# EAGLE schematic xuefei-lab7 (EAGLE 7.5.0)
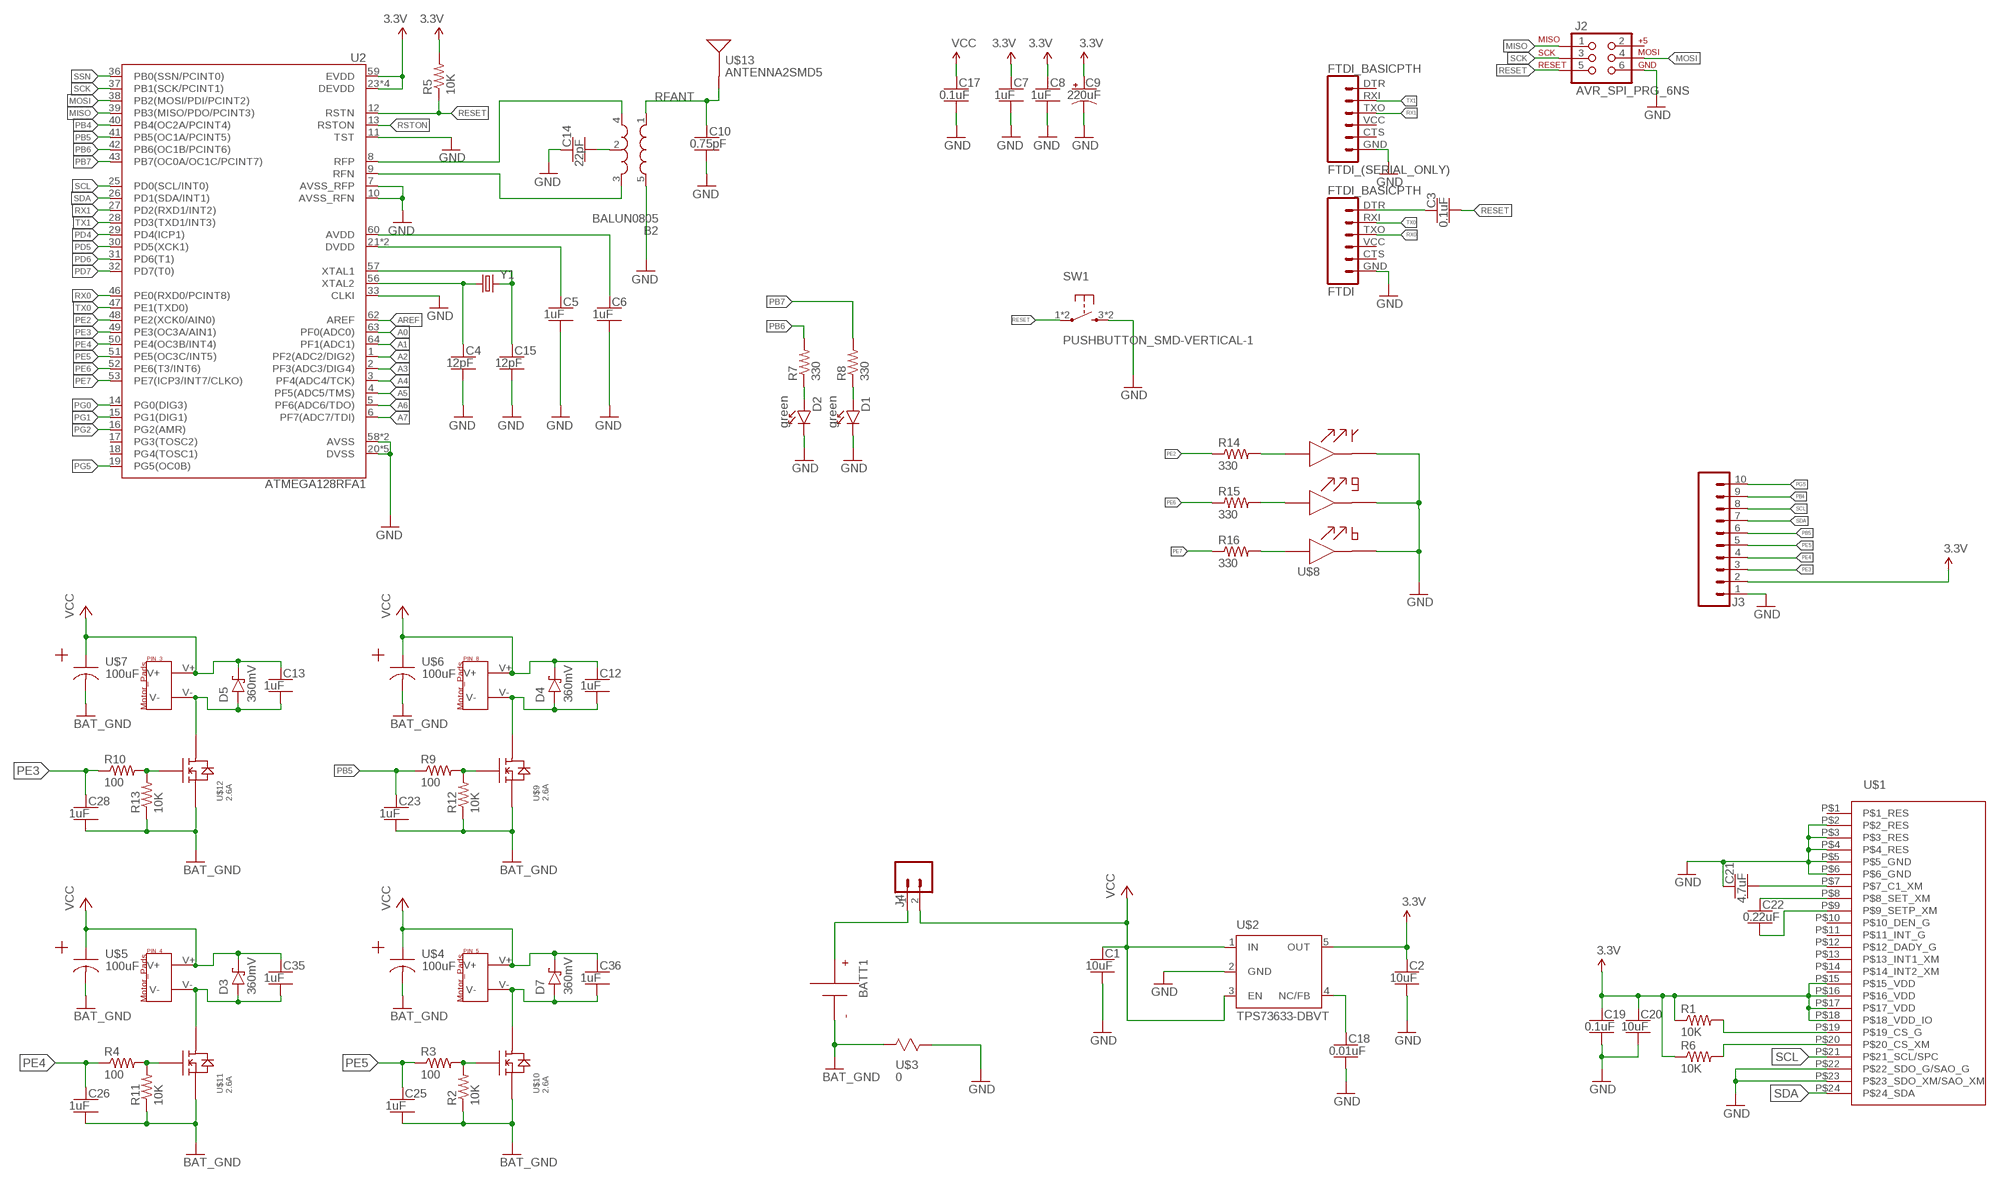
[diagram p0: schematic, sheet 1]

## Parts
B2  BALUN0805  [BALUN]
BATT1  BATTERY-HUBSAN-W/HOLDER  [BATTERY-W/HOLDER-380MAH-HUBSAN]
C1  10uF  CAPACITOR-NP_SMD-2012-0805_CERAMIC-10UF  [CAPC2012X140_HS]
C2  10uF  CAPACITOR-NP_SMD-2012-0805_CERAMIC-10UF  [CAPC2012X140_HS]
C3  0.1uF  CAPACITOR-NP_SMD-2012-0805_CERAMIC-0.1UF  [CAPC2012X140_HS]
C4  12pF  CAPACITOR-NP_SMD-2012-0805_CERAMIC-12PF  [CAPC2012X140_HS]
C5  1uF  CAPACITOR-NP_SMD-2012-0805_CERAMIC-1UF  [CAPC2012X140_HS]
C6  1uF  CAPACITOR-NP_SMD-2012-0805_CERAMIC-1UF  [CAPC2012X140_HS]
C7  1uF  CAPACITOR-NP_SMD-2012-0805_CERAMIC-1UF  [CAPC2012X140_HS]
C8  1uF  CAPACITOR-NP_SMD-2012-0805_CERAMIC-1UF  [CAPC2012X140_HS]
C9  220uF  CAPACITOR-POL_SMD-7043-D_TANTALUM-220UF  [CAPMP7343X310_HS]
C10  0.75pF  CAPACITOR-NP_SMD-2012-0805_CERAMIC-0.75PF  [CAPC2012X140_HS]
C12  1uF  CAPACITOR-NP_SMD-2012-0805_CERAMIC-1UF  [CAPC2012X140_HS]
C13  1uF  CAPACITOR-NP_SMD-2012-0805_CERAMIC-1UF  [CAPC2012X140_HS]
C14  22pF  CAPACITOR-NP_SMD-2012-0805_CERAMIC-22PF  [CAPC2012X140_HS]
C15  12pF  CAPACITOR-NP_SMD-2012-0805_CERAMIC-12PF  [CAPC2012X140_HS]
C17  0.1uF  CAPACITOR-NP_SMD-2012-0805_CERAMIC-0.1UF  [CAPC2012X140_HS]
C18  0.01uF  CAPACITOR-NP_SMD-2012-0805_CERAMIC-0.01UF  [CAPC2012X140_HS]
C19  0.1uF  CAPACITOR-NP_SMD-2012-0805_CERAMIC-0.1UF  [CAPC2012X140_HS]
C20  10uF  CAPACITOR-NP_SMD-2012-0805_CERAMIC-10UF  [CAPC2012X140_HS]
C21  4.7uF  CAPACITOR-NP_SMD-2012-0805_CERAMIC-4.7UF  [CAPC2012X140_HS]
C22  0.22uF  CAPACITOR-NP_SMD-2012-0805_CERAMIC-0.22UF  [CAPC2012X140_HS]
C23  1uF  CAPACITOR-NP_SMD-2012-0805_CERAMIC-1UF  [CAPC2012X140_HS]
C25  1uF  CAPACITOR-NP_SMD-2012-0805_CERAMIC-1UF  [CAPC2012X140_HS]
C26  1uF  CAPACITOR-NP_SMD-2012-0805_CERAMIC-1UF  [CAPC2012X140_HS]
C28  1uF  CAPACITOR-NP_SMD-2012-0805_CERAMIC-1UF  [CAPC2012X140_HS]
C35  1uF  CAPACITOR-NP_SMD-2012-0805_CERAMIC-1UF  [CAPC2012X140_HS]
C36  1uF  CAPACITOR-NP_SMD-2012-0805_CERAMIC-1UF  [CAPC2012X140_HS]
D1  green  DIODE-LED_SMD-2012-0805-GREEN  [LEDSC125X200X120-2_HS]
D2  green  DIODE-LED_SMD-2012-0805-GREEN  [LEDSC125X200X120-2_HS]
D3  360mV  DIODE-SCHOTTKY_SMD-SOD123-360MV  [SOD3716X135_HS]
D4  360mV  DIODE-SCHOTTKY_SMD-SOD123-360MV  [SOD3716X135_HS]
D5  360mV  DIODE-SCHOTTKY_SMD-SOD123-360MV  [SOD3716X135_HS]
D7  360mV  DIODE-SCHOTTKY_SMD-SOD123-360MV  [SOD3716X135_HS]
FTDI  FTDI_BASICPTH  [FTDI_BASIC]
FTDI_(SERIAL_ONLY)  FTDI_BASICPTH  [FTDI_BASIC]
J2  AVR_SPI_PRG_6NS  [2X3-NS]
J3  SIP-10_TH-254X10-1  [HDRV10W63P254_10X1_2540X254H838_HS]
J4  MALE_HEADER_2POS-2X1-0.1IN  [MALE_HEADER_2X1_0.1IN]
PIN_3  MOTOR_PADS  [MOTOR_PADS]
PIN_4  MOTOR_PADS  [MOTOR_PADS]
PIN_5  MOTOR_PADS  [MOTOR_PADS]
PIN_8  MOTOR_PADS  [MOTOR_PADS]
R1  10K  RESISTOR_SMD-2012-0805-10K  [RESC2012X60_HS]
R2  10K  RESISTOR_SMD-2012-0805-10K  [RESC2012X60_HS]
R3  100  RESISTOR_SMD-2012-0805-100  [RESC2012X60_HS]
R4  100  RESISTOR_SMD-2012-0805-100  [RESC2012X60_HS]
R5  10K  RESISTOR_SMD-2012-0805-10K  [RESC2012X60_HS]
R6  10K  RESISTOR_SMD-2012-0805-10K  [RESC2012X60_HS]
R7  330  RESISTOR_SMD-2012-0805-330  [RESC2012X60_HS]
R8  330  RESISTOR_SMD-2012-0805-330  [RESC2012X60_HS]
R9  100  RESISTOR_SMD-2012-0805-100  [RESC2012X60_HS]
R10  100  RESISTOR_SMD-2012-0805-100  [RESC2012X60_HS]
R11  10K  RESISTOR_SMD-2012-0805-10K  [RESC2012X60_HS]
R12  10K  RESISTOR_SMD-2012-0805-10K  [RESC2012X60_HS]
R13  10K  RESISTOR_SMD-2012-0805-10K  [RESC2012X60_HS]
R14  330  RESISTOR_SMD-2012-0805-330  [RESC2012X60_HS]
R15  330  RESISTOR_SMD-2012-0805-330  [RESC2012X60_HS]
R16  330  RESISTOR_SMD-2012-0805-330  [RESC2012X60_HS]
SW1  PUSHBUTTON_SMD-VERTICAL-1  [TE_FSM8JSMA_HS]
U2  ATMEGA128RFA1  [QFN-64]
U$1  IMU  [LGA-24_4X4MM]
U$2  TPS73633-DBVT  [SOT23-DBV]
U$3  0  RESISTOR  [SMD_RESISTOR]
U$4  100uF  POLAR_CAP  [TAJB_SMB_POLAR_CAP]
U$5  100uF  POLAR_CAP  [TAJB_SMB_POLAR_CAP]
U$6  100uF  POLAR_CAP  [TAJB_SMB_POLAR_CAP]
U$7  100uF  POLAR_CAP  [TAJB_SMB_POLAR_CAP]
U$8  QBLP679E-RGB  [QBLP679E-RGB]
U$9  2.6A  N-CHANNEL_MOSFETW/_HEAT_SINK  [LITTLE_FOOT_MOSFET_W/_HEAT_SPREADER]
U$10  2.6A  N-CHANNEL_MOSFETW/_HEAT_SINK  [LITTLE_FOOT_MOSFET_W/_HEAT_SPREADER]
U$11  2.6A  N-CHANNEL_MOSFETW/_HEAT_SINK  [LITTLE_FOOT_MOSFET_W/_HEAT_SPREADER]
U$12  2.6A  N-CHANNEL_MOSFETW/_HEAT_SINK  [LITTLE_FOOT_MOSFET_W/_HEAT_SPREADER]
U$13  ANTENNA2SMD5  [ANTENNA-CHIP5]
Y1  CRYSTAL5X3  [CRYSTAL-SMD-5X3]

## Nets
3.3V: C2.1 C7.1 C8.1 C9.1(+) C19.1 C20.1 J3.2 R1.1 R5.2 R6.1 U2.23(DEVDD) U2.34(DEVDD) U2.44(DEVDD) U2.54(DEVDD) U2.59(EVDD) U$1.P$15(P$15_VDD) U$1.P$16(P$16_VDD) U$1.P$17(P$17_VDD) U$1.P$18(P$18_VDD_IO) U$2.5(OUT)
A0: U2.63(PF0(ADC0))
A1: U2.64(PF1(ADC1))
A2: U2.1(PF2(ADC2/DIG2))
A3: U2.2(PF3(ADC3/DIG4))
A4: U2.3(PF4(ADC4/TCK))
A5: U2.4(PF5(ADC5/TMS))
A6: U2.5(PF6(ADC6/TDO))
A7: U2.6(PF7(ADC7/TDI))
AREF: U2.62(AREF)
AVDD: C6.1 U2.60(AVDD)
BAT_GND: BATT1.-(N) C23.2 C25.2 C26.2 C28.2 R2.1 R11.1 R12.1 R13.1 U$3.P$1 U$4.P$2 U$5.P$2 U$6.P$2 U$7.P$2 U$9.P$2(P$2_S) U$10.P$2(P$2_S) U$11.P$2(P$2_S) U$12.P$2(P$2_S)
DTR: C3.1 FTDI.DTR
DVDD: C5.1 U2.21(DVDD) U2.22(DVDD)
GND: B2.5(GND) C1.2 C2.2 C4.2 C5.2 C6.2 C7.2 C8.2 C9.2(-) C10.2 C14.1 C15.2 C17.2 C18.2 C19.2 C20.2 C21.1 D1.C D2.C FTDI.GND FTDI_(SERIAL_ONLY).GND J2.6 J3.1 SW1.3 SW1.4 U2.7(AVSS_RFP) U2.10(AVSS_RFN) U2.11(TST) U2.20(DVSS) U2.24(DVSS) U2.33(CLKI) U2.35(DVSS) U2.45(DVSS) U2.55(DVSS) U2.58(AVSS) U2.61(AVSS) U$1.P$2(P$2_RES) U$1.P$3(P$3_RES) U$1.P$4(P$4_RES) U$1.P$5(P$5_GND) U$1.P$6(P$6_GND) U$1.P$22(P$22_SDO_G/SAO_G) U$1.P$23(P$23_SDO_XM/SAO_XM) U$2.2(GND) U$3.P$2 U$8.P$1 U$8.P$2 U$8.P$3
MISO: J2.1 U2.39(PB3(MISO/PDO/PCINT3))
MOSI: J2.4 U2.38(PB2(MOSI/PDI/PCINT2))
N$1: R14.2 U$8.P$4
N$2: R15.2 U$8.P$5
N$3: C15.1 U2.57(XTAL1) Y1.3
N$4: C4.1 U2.56(XTAL2) Y1.1
N$5: C18.1 U$2.4(NC/FB)
N$6: C21.2 U$1.P$7(P$7_C1_XM)
N$7: B2.2(GND) C14.2
N$8: D2.A R7.1
N$9: R16.2 U$8.P$6
N$12: C22.1 U$1.P$8(P$8_SET_XM)
N$13: D1.A R8.1
N$14: C22.2 U$1.P$9(P$9_SETP_XM)
N$15: R1.2 U$1.P$19(P$19_CS_G)
N$16: R6.2 U$1.P$20(P$20_CS_XM)
N$17: BATT1.+(P) J4.1
N$18: R9.2 R12.2 U$9.P$1(P$1_G)
N$19 [HighAmps]: C12.2 D4.A PIN_8.V- U$9.P$3(P$3_D)
N$21: R2.2 R3.2 U$10.P$1(P$1_G)
N$22 [HighAmps]: C36.2 D7.A PIN_5.V- U$10.P$3(P$3_D)
N$24: R10.2 R13.2 U$12.P$1(P$1_G)
N$25 [HighAmps]: C13.2 D5.A PIN_3.V- U$12.P$3(P$3_D)
N$27: R4.2 R11.2 U$11.P$1(P$1_G)
N$28 [HighAmps]: C35.2 D3.A PIN_4.V- U$11.P$3(P$3_D)
PB4: J3.9 U2.40(PB4(OC2A/PCINT4))
PB5: C23.1 J3.6 R9.1 U2.41(PB5(OC1A/PCINT5))
PB6: R7.2 U2.42(PB6(OC1B/PCINT6))
PB7: R8.2 U2.43(PB7(OC0A/OC1C/PCINT7))
PD4: U2.29(PD4(ICP1))
PD5: U2.30(PD5(XCK1))
PD6: U2.31(PD6(T1))
PD7: U2.32(PD7(T0))
PE2: R14.1 U2.48(PE2(XCK0/AIN0))
PE3: C28.1 J3.3 R10.1 U2.49(PE3(OC3A/AIN1))
PE4: C26.1 J3.4 R4.1 U2.50(PE4(OC3B/INT4))
PE5: C25.1 J3.5 R3.1 U2.51(PE5(OC3C/INT5))
PE6: R15.1 U2.52(PE6(T3/INT6))
PE7: R16.1 U2.53(PE7(ICP3/INT7/CLKO))
PG0: U2.14(PG0(DIG3))
PG1: U2.15(PG1(DIG1))
PG2: U2.16(PG2(AMR))
PG5: J3.10 U2.19(PG5(OC0B))
RESET: C3.2 J2.5 R5.1 SW1.1 SW1.2 U2.12(RSTN)
RFANT: B2.1(IN) C10.1 U$13.FEED(SIGNAL)
RFN: B2.3(OUT2) U2.9(RFN)
RFP: B2.4(OUT1) U2.8(RFP)
RSTON: U2.13(RSTON)
RX0: FTDI.TXO U2.46(PE0(RXD0/PCINT8))
RX1: FTDI_(SERIAL_ONLY).TXO U2.27(PD2(RXD1/INT2))
SCK: J2.3 U2.37(PB1(SCK/PCINT1))
SCL: J3.8 U2.25(PD0(SCL/INT0)) U$1.P$21(P$21_SCL/SPC)
SDA: J3.7 U2.26(PD1(SDA/INT1)) U$1.P$24(P$24_SDA)
SSN: U2.36(PB0(SSN/PCINT0))
TX0: FTDI.RXI U2.47(PE1(TXD0))
TX1: FTDI_(SERIAL_ONLY).RXI U2.28(PD3(TXD1/INT3))
VCC: C1.1 C12.1 C13.1 C17.1 C35.1 C36.1 D3.C D4.C D5.C D7.C J4.2 PIN_3.V+ PIN_4.V+ PIN_5.V+ PIN_8.V+ U$2.1(IN) U$2.3(EN) U$4.P$1 U$5.P$1 U$6.P$1 U$7.P$1
Unconnected: FTDI.CTS FTDI.VCC FTDI_(SERIAL_ONLY).CTS FTDI_(SERIAL_ONLY).DTR FTDI_(SERIAL_ONLY).VCC J2.2 U2.17(PG3(TOSC2)) U2.18(PG4(TOSC1)) U$1.P$1(P$1_RES) U$1.P$10(P$10_DEN_G) U$1.P$11(P$11_INT_G) U$1.P$12(P$12_DADY_G) U$1.P$13(P$13_INT1_XM) U$1.P$14(P$14_INT2_XM)

## Library data of the parts
B2 = quadparts_prebuilt:BALUN: 0805 footprint balun- Ember 351/357; DATASHEET: http://katalog.we-online.de/pbs/datasheet/748421245.pdf; DIST: Digikey; DISTPN: 732-2230-6-ND; MFR: Wurth Electronics Inc; MPN: 748421245; PRICE: 2.63
BATT1 = quadparts_prebuilt:BATTERY; CREATOR: Swanson; DIST: AMAZON; DISTPN: http://www.amazon.com/dp/B00RROB6Q4?smid=AMNTPWSAB5H0S; MFR: HUBSAN; MPN: X4-H107C-8-in-1
C1 C2 C20 = quadparts_prebuilt:CAPACITOR-NP_: Nonpolarized capacitor; DIST: Digikey; DISTPN: 490-5523-1-ND; MFR: Murata Electronics North America; MPN: GRM21BR61E106KA73L
C3 C17 C19 = quadparts_prebuilt:CAPACITOR-NP_: Nonpolarized capacitor; DIST: Digikey; DISTPN: 490-1666-1-ND; MFR: Murata Electronics North America; MPN: GRM21BR71H104KA01L
C4 C15 = quadparts_prebuilt:CAPACITOR-NP_: Nonpolarized capacitor; DIST: Digikey; DISTPN: 490-5531-1-ND; MFR: Murata Electronics North America; MPN: GRM21A5C2E120JW01D
C5-C8 C12 C13 C23 C25 C26 C28 C35 C36 = quadparts_prebuilt:CAPACITOR-NP_: Nonpolarized capacitor; DIST: Digikey; DISTPN: 490-4736-1-ND; MFR: Murata Electronics North America; MPN: GRM21BR71H105KA12L
C9 = quadparts_prebuilt:CAPACITOR-POL_: Polarized capacitor; DIST: Digikey; DISTPN: 478-8912-1-ND; MFR: AVX Corporation; MPN: TAJD227K006RNJ
C10 = quadparts_prebuilt:CAPACITOR-NP_: Nonpolarized capacitor; DIST: Digikey; DISTPN: 490-3585-1-ND; MFR: Murata Electronics North America; MPN: GQM2195C2AR75CB01D
C14 = quadparts_prebuilt:CAPACITOR-NP_: Nonpolarized capacitor; DIST: Digikey; DISTPN: 490-5534-1-ND; MFR: Murata Electronics North America; MPN: GRM21A5C2E220JW01D
C18 = quadparts_prebuilt:CAPACITOR-NP_: Nonpolarized capacitor; DIST: Digikey; DISTPN: 490-8295-1-ND; MFR: Murata Electronics North America; MPN: GRM2195C1H103FA01D
C21 = quadparts_prebuilt:CAPACITOR-NP_: Nonpolarized capacitor; DIST: Digikey; DISTPN: 490-3335-1-ND; MFR: Murata Electronics North America; MPN: GRM21BR61E475KA12L
C22 = quadparts_prebuilt:CAPACITOR-NP_: Nonpolarized capacitor; DIST: Digikey; DISTPN: 490-1670-1-ND; MFR: Murata Electronics North America; MPN: GRM21BR71H224KA01L
D1 D2 = quadparts_prebuilt:DIODE-LED_: Light emitting diode; DIST: Digikey; DISTPN: 160-1179-1-ND; MFR: Lite-On Inc; MPN: LTST-C170GKT
D3-D5 D7 = quadparts_prebuilt:DIODE-SCHOTTKY_: Schottky diode; DIST: Digikey; DISTPN: CRS08QMCT-ND; MFR: Toshiba Semiconductor and Storage; MPN: CRS08(TE85L,Q,M)
FTDI FTDI_(SERIAL_ONLY) = quadparts_prebuilt:FTDI_BASIC: FTDI Basic header with labels; DATASHEET: http://portal.fciconnect.com/Comergent//fci/drawing/68015.pdf; DIST: Digikey; DISTPN: 609-3327-ND; MFR: Amphenol FCI; MPN: 68016-406HLF; PRICE: 0.33
J2 = quadparts_prebuilt:AVR_SPI_PRG_6: AVR ISP 6 Pin This is the reduced ISP connector for AVR programming. Common on Arduino. This footprint will take up less PCB space and can be used with a 10-pin to 6-pin adapter such as SKU: BOB-08508; DATASHEET: http://portal.fciconnect.com/Comergent//fci/drawing/67996.pdf; DIST: Digikey; DISTPN: 609-3234-ND; MFR: Amphenol FCI; MPN: 67997-206HLF; PRICE: 0.31
J3 = quadparts_prebuilt:SIP-10_: 10 pin single inline pin header, socket, or connector; DIST: Digikey; DISTPN: 609-3250-ND; MFR: Amphenol FCI; MPN: 68000-110HLF
J4 = quadparts:MALE_HEADER_2POS: 2 pin single inline pin header, socket, or connector; CREATOR: SWANSON; DIST: Digikey; DISTPN: 3M9447-ND; MFR: 3M; MPN: 961102-6404-AR
PIN_3-PIN_5 PIN_8 = quadparts_prebuilt:MOTOR_PADS; DIST: NA; DISTPN: NA; MFR: NA; MPN: NA
R1 R2 R5 R6 R11-R13 = quadparts_prebuilt:RESISTOR_: Resistor; DIST: Digikey; DISTPN: 311-10KARCT-ND; MFR: Yageo; MPN: RC0805JR-0710KL
R3 R4 R9 R10 = quadparts_prebuilt:RESISTOR_: Resistor; DIST: Digikey; DISTPN: 311-100ARCT-ND; MFR: Yageo; MPN: RC0805JR-07100RL
R7 R8 R14-R16 = quadparts_prebuilt:RESISTOR_: Resistor; DIST: Digikey; DISTPN: 311-330ARCT-ND; MFR: Yageo; MPN: RC0805JR-07330RL
SW1 = quadparts_prebuilt:PUSHBUTTON_: Pushbutton with 2 pins shorting 1 to 2 and two extra mounting pins 3 & 4; DIST: Digikey; DISTPN: 450-1129-ND; MFR: TE Connectivity Alcoswitch Switches; MPN: FSM4JSMA
U2 = quadparts_prebuilt:ATMEGA128RFA1: ATmega128RFA1 8-bit AVR Microcontroller with Low Power 2.4GHz Transceiver for ZigBee and IEEE 802.15.4; DATASHEET: http://www.atmel.com/Images/Atmel-8266-MCU_Wireless-ATmega128RFA1_Datasheet.pdf; DIST: Digikey; DISTPN: ATMEGA128RFA1-ZUR00DKR-ND; MFR: Atmel; MPN: ATMEGA128RFA1-ZUR00; PRICE: 10.21
U$1 = quadparts:IMU; CREATOR: Xuefei; DIST: DIGIKEY; DISTPN: 497-13902-1-ND; MFR: STMicroelectronics; MPN: LSM9DS0TR
U$2 = quadparts_prebuilt:TPS73633-DBVT; DATASHEET: http://www.ti.com/lit/ds/symlink/lp3985.pdf; DIST: Digikey; DISTPN: LP3985IM5X-3.0/NOPBCT-ND; MFR: Texas Instruments; MPN: LP3985IM5X-3.0/NOPB; PRICE: 0.59
U$3 = quadparts:RESISTOR; CREATOR: Xuefei; DIST: DIGIKEY; DISTPN: 311-0.0ARCT-ND; MFR: Yageo; MPN: RC0805JR-070RL
U$4-U$7 = quadparts:POLAR_CAP; CREATOR: Xuefei; DIST: DIGIKEY; DISTPN: 478-1677-1-ND; MFR: AVX Corporation; MPN: TAJB107K006RNJ
U$8 = quadparts:QBLP679E-RGB; CREATOR: Xuefei; DIST: DIGIKEY; DISTPN: 1516-1131-1-ND; MFR: QT Brightek (QTB); MPN: QBLP679E-RGB
U$9-U$12 = quadparts:N-CHANNEL_MOSFET; CREATOR: Xuefei; DIST: DIGIKEY; DISTPN: SI2302CDS-T1-E3CT-ND; MFR: Vishay Siliconix; MPN: SI2302CDS-T1-E3
U$13 = quadparts_prebuilt:ANTENNA2: Chip antenna Single endded antenna. Common with smaller chip antennas. CHIP4 package is the GPS Chip Antenna SKU: GPS-08418. CHIP5 package is 2.4GHz chip antenna SKU: WRL-00144.; DATASHEET: http://www.linxtechnologies.com/resources/data-guides/ant-xxx-chp-x.pdf; DIST: Digikey; DISTPN: ANT-2.45-CHPCT-ND; MFR: Linx Technologies Inc.; MPN: ANT-2.45-CHP-T; PRICE: 3.16
Y1 = quadparts_prebuilt:CRYSTAL: Various standard crystals. Proven footprints.; DATASHEET: http://www.abracon.com/Resonators/abm3b.pdf; DIST: Digikey; DISTPN: 535-9122-1-ND; MFR: Abracon LLC; MPN: ABM3B-16.000MHZ-B2-T; PRICE: 0.68; PROD_ID: XTAL-08218

## Net classes
1 HighAmps: width 0.762 mm